# Altium schematic sheet Power.SchDoc
size A4
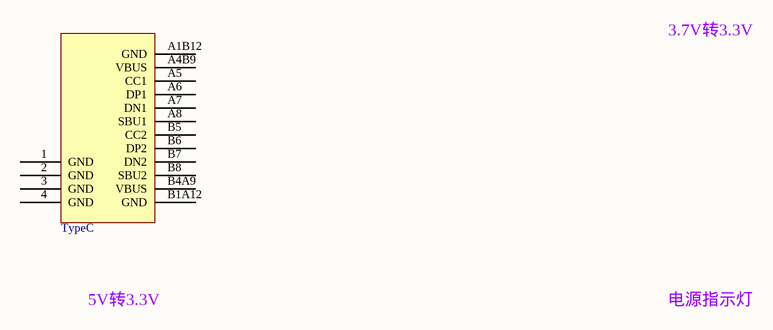
[diagram p0: Power.SchDoc]

## Parts
?  TypeC

## Nets

Not connected (* = marked no-connect by the designer): ? 1(GND) 2(GND) 3(GND) 4(GND) A1B12(GND) A4B9(VBUS) A5(CC1) A6(DP1) A7(DN1) A8(SBU1) B1A12(GND) B4A9(VBUS) B5(CC2) B6(DP2) B7(DN2) B8(SBU2)

## Notes on the sheet
- 3.7V转3.3V
- 5V转3.3V
- 电源指示灯

## Library data of the parts
? = TYPE-C